# EAGLE design untitled (EAGLE 6.6.0)
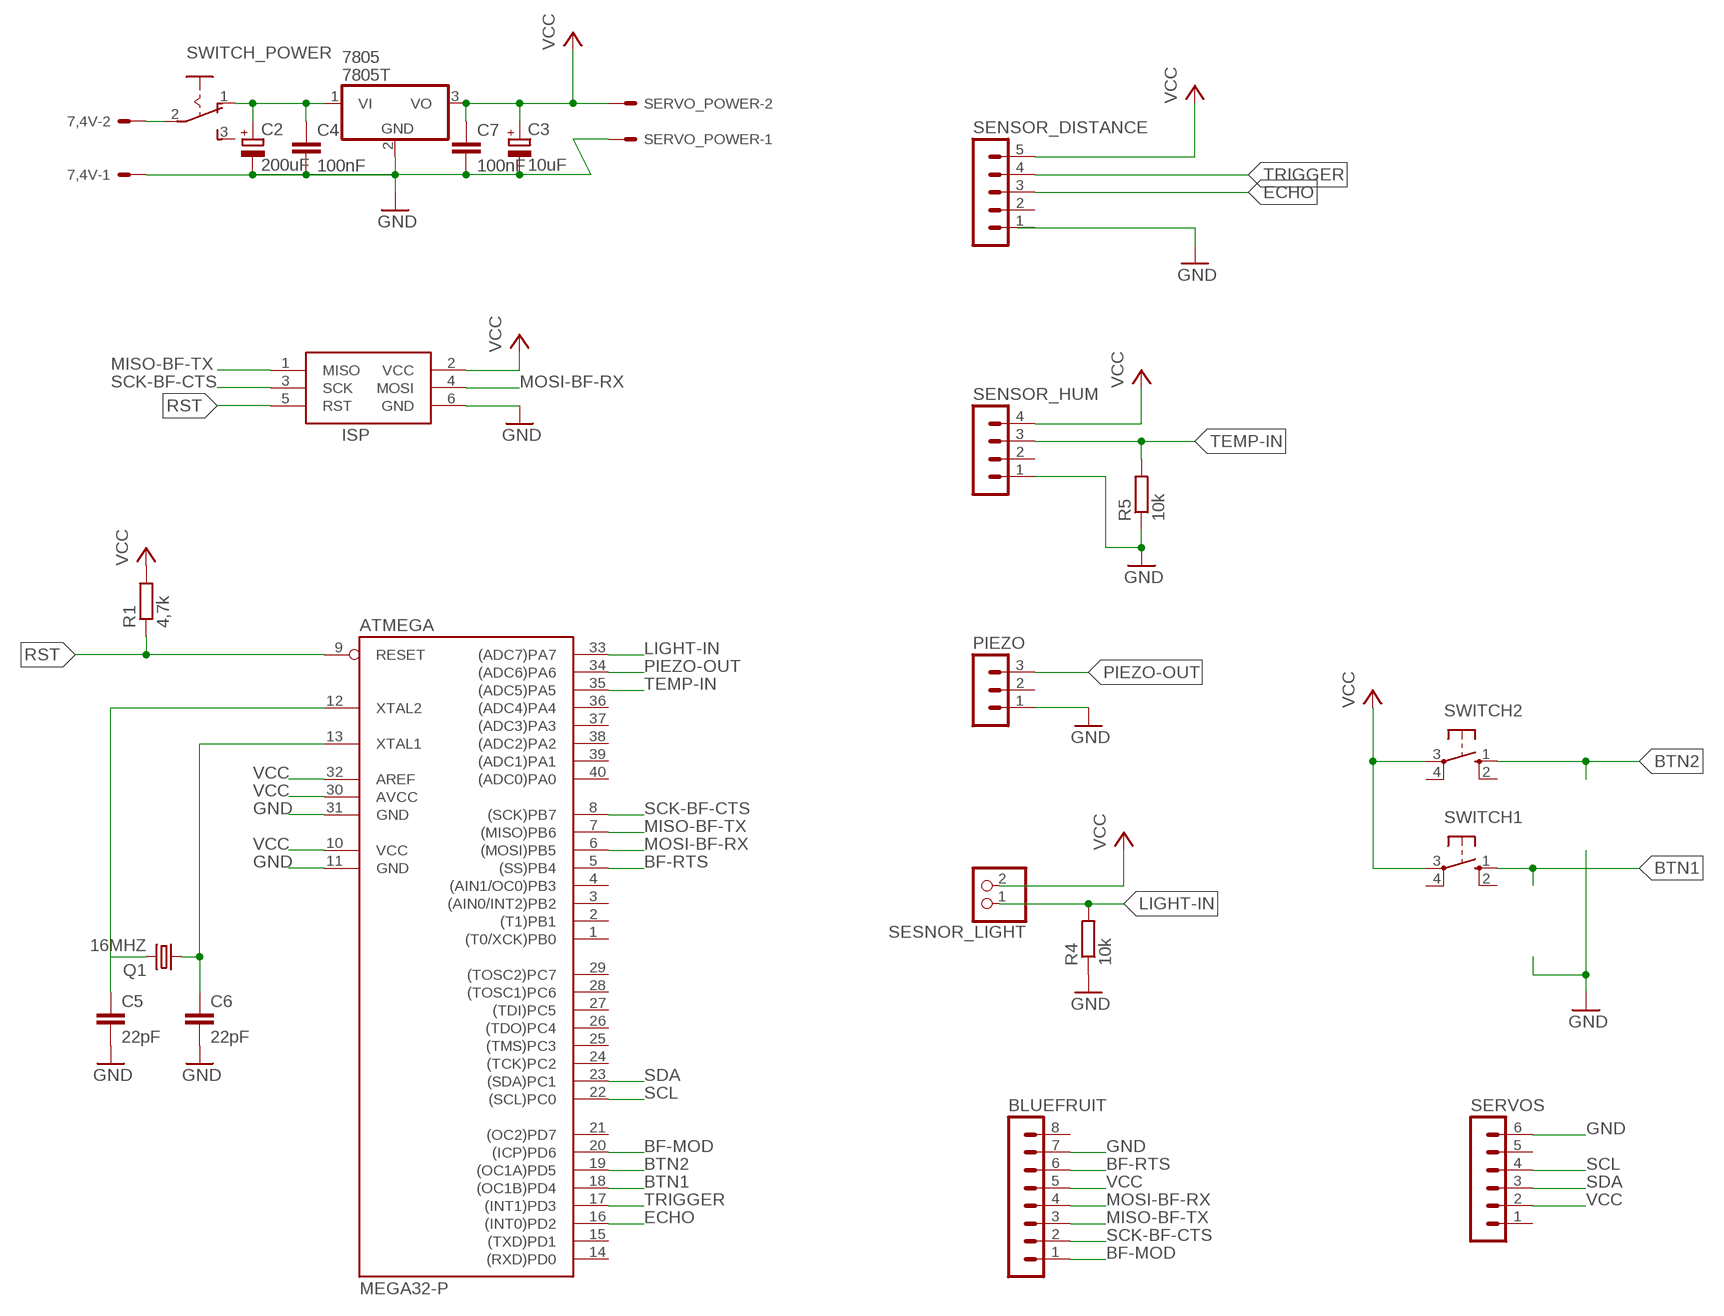
[diagram p0: schematic, sheet 1]

## Parts
7,4V  KK-156-2  [KK-156-2]
7805  7805T  [TO220H]
ATMEGA  MEGA32-P  [DIL40]
BLUEFRUIT  MA08-1  [MA08-1]
C2  200uF  CPOL-EUE5-10.5  [E5-10,5]
C3  10uF  CPOL-EUE5-10.5  [E5-10,5]
C4  100nF  C-EU025-025X050  [C025-025X050]
C5  22pF  C-EU025-025X050  [C025-025X050]
C6  22pF  C-EU025-025X050  [C025-025X050]
C7  100nF  C-EU025-025X050  [C025-025X050]
ISP  AVRISP-6  [AVRISP]
PIEZO  MA03-1  [MA03-1]
Q1  16MHZ  CRYSTALHC49S  [HC49/S]
R1  4,7k  R-EU_0207/10  [0207/10]
R4  10k  R-EU_0207/10  [0207/10]
R5  10k  R-EU_0207/10  [0207/10]
SENSOR_DISTANCE  MA05-1  [MA05-1]
SENSOR_HUM  MA04-1  [MA04-1]
SERVO_POWER  KK-156-2  [KK-156-2]
SERVOS  MA06-1  [MA06-1]
SESNOR_LIGHT  PINHD-1X2  [1X02]
SWITCH1  10-XX  [B3F-10XX]
SWITCH2  10-XX  [B3F-10XX]
SWITCH_POWER  255SB  [255SB]

## Nets
BF-MOD: ATMEGA.20((ICP)PD6) BLUEFRUIT.1
BF-RTS: ATMEGA.5((SS)PB4) BLUEFRUIT.6
BTN1: ATMEGA.18((OC1B)PD4) SWITCH1.1(S)
BTN2: ATMEGA.19((OC1A)PD5) SWITCH2.1(S)
ECHO: ATMEGA.16((INT0)PD2) SENSOR_DISTANCE.3
GND: 7,4V.1 7805.2(GND) ATMEGA.11(GND) ATMEGA.31(GND) BLUEFRUIT.7 C2.- C3.- C4.2 C5.2 C6.2 C7.2 ISP.6(GND) PIEZO.1 R4.1 R5.1 SENSOR_HUM.1 SERVO_POWER.1 SERVOS.6
LIGHT-IN: ATMEGA.33((ADC7)PA7) R4.2 SESNOR_LIGHT.1
MISO-BF-TX: ATMEGA.7((MISO)PB6) BLUEFRUIT.3 ISP.1(MISO)
MOSI-BF-RX: ATMEGA.6((MOSI)PB5) BLUEFRUIT.4 ISP.4(MOSI)
N$1: 7,4V.2 SWITCH_POWER.2(P)
N$2: ATMEGA.12(XTAL2) C5.1 Q1.2
N$3: ATMEGA.13(XTAL1) C6.1 Q1.1
PIEZO-OUT: ATMEGA.34((ADC6)PA6) PIEZO.3
RST: ATMEGA.9(RESET) ISP.5(RST) R1.1
SCK-BF-CTS: ATMEGA.8((SCK)PB7) BLUEFRUIT.2 ISP.3(SCK)
SCL: ATMEGA.22((SCL)PC0) SERVOS.4
SDA: ATMEGA.23((SDA)PC1) SERVOS.3
TEMP-IN: ATMEGA.35((ADC5)PA5) R5.2 SENSOR_HUM.3
TRIGGER: ATMEGA.17((INT1)PD3) SENSOR_DISTANCE.4
VCC: 7805.3(VO) ATMEGA.10(VCC) ATMEGA.30(AVCC) ATMEGA.32(AREF) BLUEFRUIT.5 C3.+ C7.1 ISP.2(VCC) R1.2 SENSOR_DISTANCE.5 SENSOR_HUM.4 SERVO_POWER.2 SERVOS.2 SESNOR_LIGHT.2 SWITCH1.3(P) SWITCH2.3(P)
VIN: 7805.1(VI) C2.+ C4.1 SWITCH_POWER.1(O)
Unconnected: ATMEGA.1((T0/XCK)PB0) ATMEGA.2((T1)PB1) ATMEGA.3((AIN0/INT2)PB2) ATMEGA.4((AIN1/OC0)PB3) ATMEGA.14((RXD)PD0) ATMEGA.15((TXD)PD1) ATMEGA.21((OC2)PD7) ATMEGA.24((TCK)PC2) ATMEGA.25((TMS)PC3) ATMEGA.26((TDO)PC4) ATMEGA.27((TDI)PC5) ATMEGA.28((TOSC1)PC6) ATMEGA.29((TOSC2)PC7) ATMEGA.36((ADC4)PA4) ATMEGA.37((ADC3)PA3) ATMEGA.38((ADC2)PA2) ATMEGA.39((ADC1)PA1) ATMEGA.40((ADC0)PA0) BLUEFRUIT.8 PIEZO.2 SENSOR_DISTANCE.1 SENSOR_DISTANCE.2 SENSOR_HUM.2 SERVOS.1 SERVOS.5 SWITCH1.2(S1) SWITCH1.4(P1) SWITCH2.2(S1) SWITCH2.4(P1) SWITCH_POWER.3(S)

## Library data of the parts
7,4V SERVO_POWER = con-molex:KK-156-2: KK 156 HEADER Source: http://www.molex.com/pdm_docs/sd/026604100_sd.pdf; OC_FARNELL: unknown; OC_NEWARK: unknown
7805 = adafruit:78*: Positive VOLTAGE REGULATOR Added bigger pads to the TO-92 package
ATMEGA = atmel:MEGA32-P: MICROCONTROLLER 32 Kbytes FLASH 2 Kbytes SRAM 1 Kbytes EEPROM USART 8-channel 10 bit ADC Source: www.atmel.com .. doc2503.pdf; MPN: ATMEGA32-16PU; OC_FARNELL: 1661729; OC_NEWARK: 51P1794
BLUEFRUIT = con-lstb:MA08-1: PIN HEADER; OC_FARNELL: unknown; OC_NEWARK: unknown
C2 C3 = rcl:CPOL-EU: POLARIZED CAPACITOR, European symbol
C4-C7 = rcl:C-EU: CAPACITOR, European symbol
ISP = adafruit:AVRISP: AVR ISP HEADER Standard 6 pin header for AVR programming
PIEZO = con-lstb:MA03-1: PIN HEADER; OC_FARNELL: unknown; OC_NEWARK: unknown
Q1 = crystal:CRYSTAL: CRYSTAL; OC_FARNELL: 1667008; OC_NEWARK: unknown
R1 R4 R5 = rcl:R-EU_: RESISTOR, European symbol
SENSOR_DISTANCE = con-lstb:MA05-1: PIN HEADER; OC_FARNELL: unknown; OC_NEWARK: unknown
SENSOR_HUM = con-lstb:MA04-1: PIN HEADER; OC_FARNELL: unknown; OC_NEWARK: unknown
SERVOS = con-lstb:MA06-1: PIN HEADER; OC_FARNELL: unknown; OC_NEWARK: unknown
SESNOR_LIGHT = pinhead:PINHD-1X2: PIN HEADER
SWITCH1 SWITCH2 = switch-omron:10-XX: OMRON SWITCH; MPN: B3F-1000; OC_FARNELL: 176432; OC_NEWARK: 36M3542
SWITCH_POWER = switch:255SB: SLIDING SWITCH Distributor Buerklin, 11G810

## Board
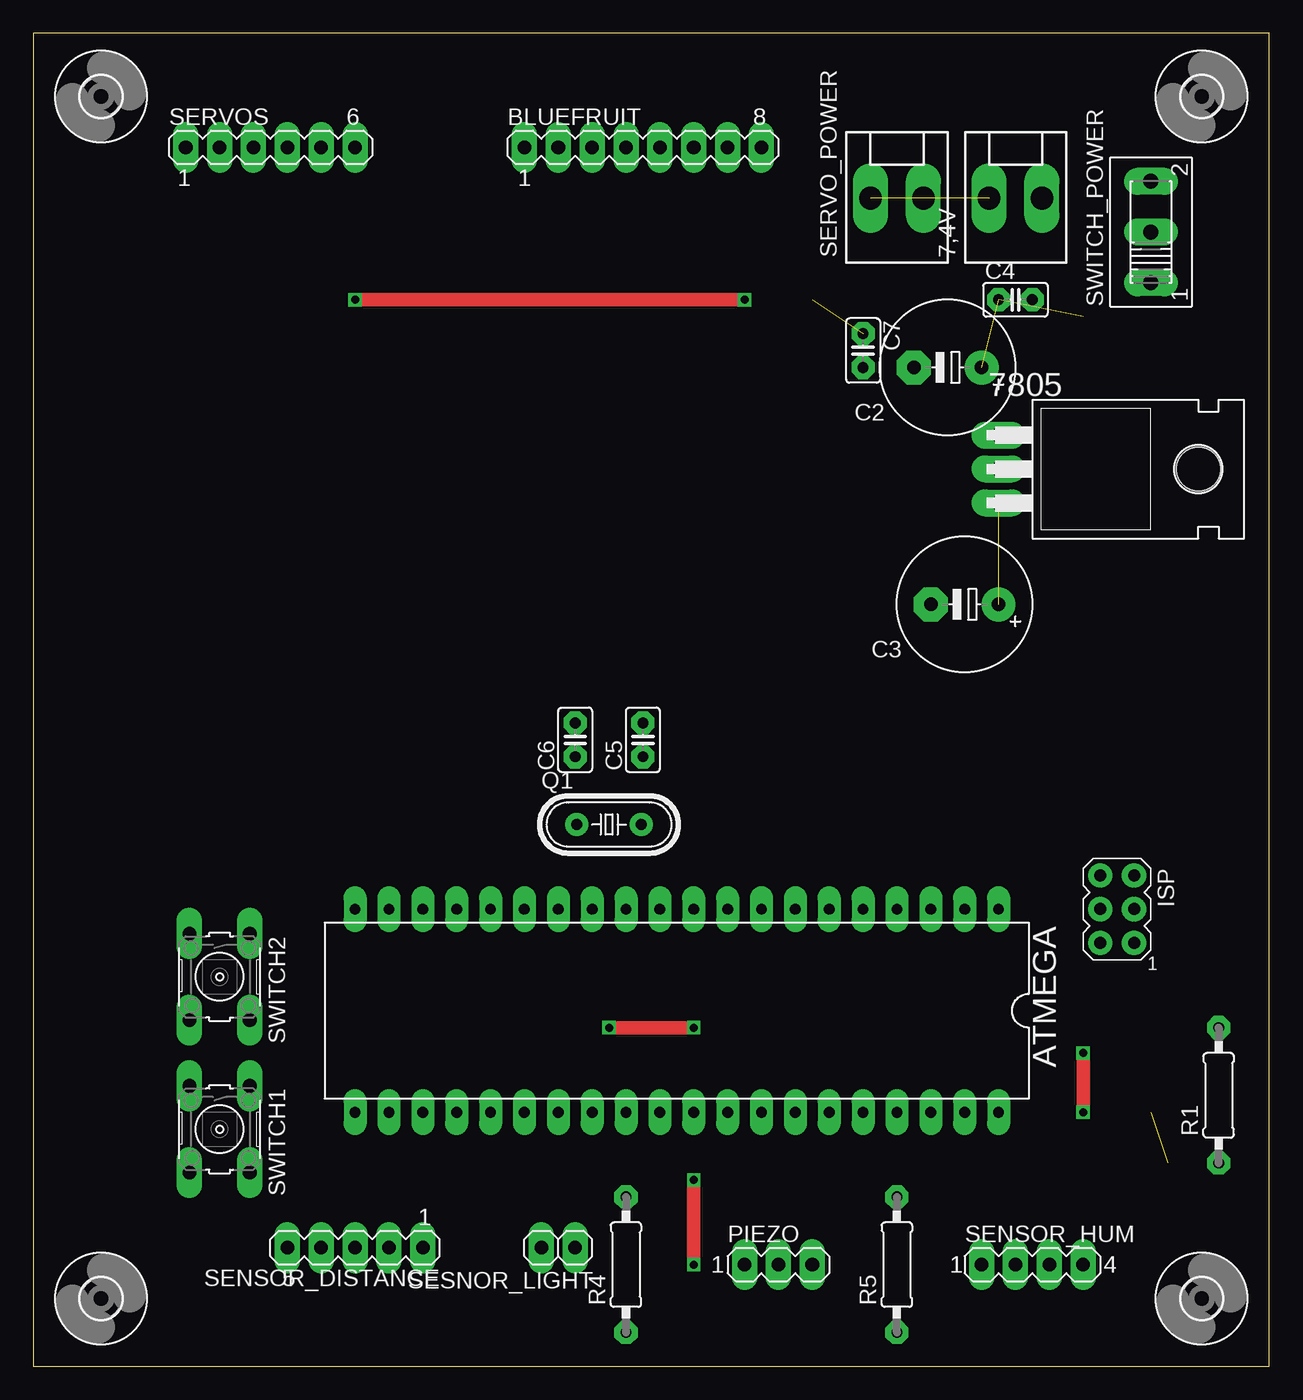
[diagram p1: board, top side]
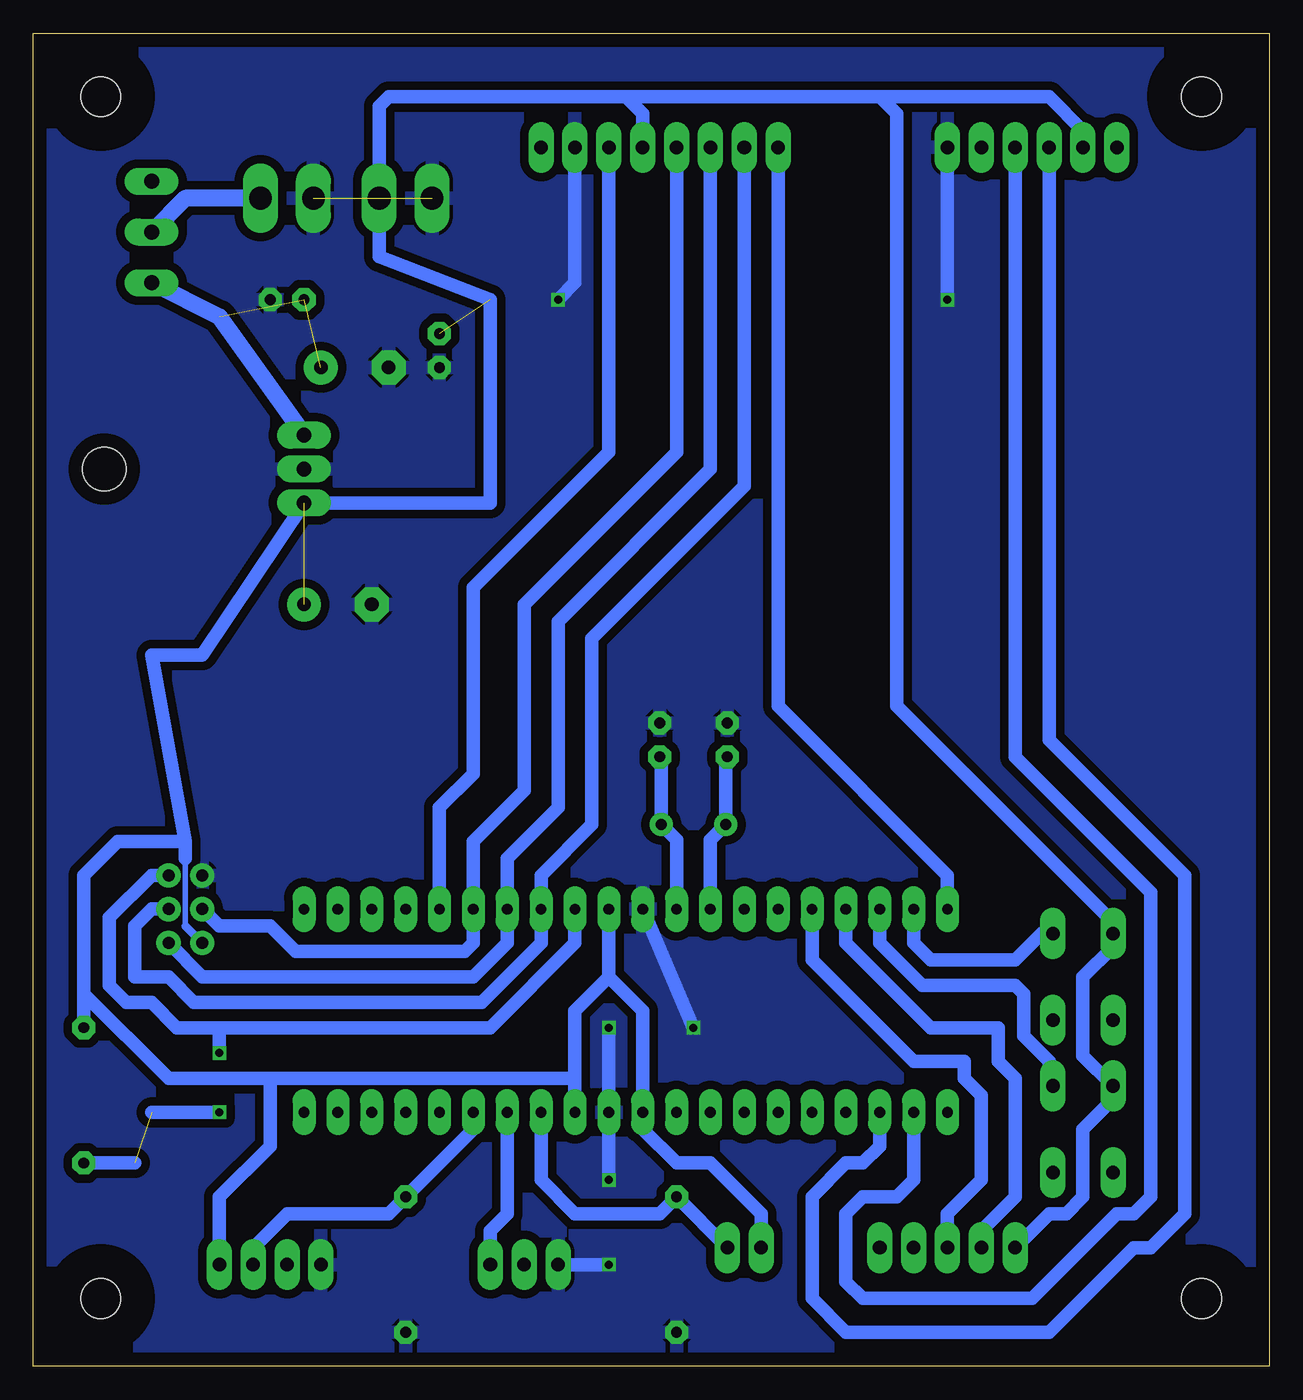
[diagram p2: board, bottom side, seen from below]

Size 92.69 x 100 mm. Coordinates in mm from the lower left corner, seen from the top.
Outline: 0,0 92.69,0 92.69,100 0,100 0,0
Copper layers (1*16): Top 0.035mm / dielectric 1.5mm / Bottom 0.035mm
Design rules "default *": minimum track width 10mil, minimum drill 24mil, track to track 25mil, track to pad 25mil, pad to pad 25mil, via to via 25mil, smd to smd 25mil, copper to edge 40mil, drill to drill 8mil, minimum pad ring 18mil, minimum via ring 8mil, stop-mask expansion 4mil, vias tented up to drill 0mil, thermal gap 10mil

### Footprints (pad centres in the part's own frame; a part is rotated, then mirrored left to right if it is on the bottom)
KK-156-2 = drill 1.7 pad 2.184 long: 1 -1.98,0; 2 1.98,0
TO220H = drill 1.118 long: 1 -2.54,-10.16; 2 0,-10.16; 3 2.54,-10.16 | hole 3.302: 0,4.826
DIL40 = drill 0.813 long: 1 -24.13,-7.62; 2 -21.59,-7.62; 3 -19.05,-7.62; 4 -16.51,-7.62; 5 -13.97,-7.62; 6 -11.43,-7.62; 7 -8.89,-7.62; 8 -6.35,-7.62; 9 -3.81,-7.62; 10 -1.27,-7.62; 11 1.27,-7.62; 12 3.81,-7.62; 13 6.35,-7.62; 14 8.89,-7.62; 15 11.43,-7.62; 16 13.97,-7.62; 17 16.51,-7.62; 18 19.05,-7.62; 19 21.59,-7.62; 20 24.13,-7.62; 21 24.13,7.62; 22 21.59,7.62; 23 19.05,7.62; 24 16.51,7.62; 25 13.97,7.62; 26 11.43,7.62; 27 8.89,7.62; 28 6.35,7.62; 29 3.81,7.62; 30 1.27,7.62; 31 -1.27,7.62; 32 -3.81,7.62; 33 -6.35,7.62; 34 -8.89,7.62; 35 -11.43,7.62; 36 -13.97,7.62; 37 -16.51,7.62; 38 -19.05,7.62; 39 -21.59,7.62; 40 -24.13,7.62
MA08-1 = drill 1.016 long: 1 -8.89,0; 2 -6.35,0; 3 -3.81,0; 4 -1.27,0; 5 1.27,0; 6 3.81,0; 7 6.35,0; 8 8.89,0
E5-10,5 = drill 1.016 pad 2.54: + -2.54,0 | drill 1.016 pad 2.54 octagon: - 2.54,0
C025-025X050 = drill 0.813 octagon: 1 -1.27,0; 2 1.27,0
AVRISP = drill 0.9 pad 1.626: 1 -1.27,2.54; 2 1.27,2.54; 3 -1.27,0; 4 1.27,0; 5 -1.27,-2.54; 6 1.27,-2.54
MA03-1 = drill 1.016 long: 1 -2.54,0; 2 0,0; 3 2.54,0
HC49/S = drill 0.813: 1 -2.413,0; 2 2.413,0
0207/10 = drill 0.813 octagon: 1 -5.08,0; 2 5.08,0
MA05-1 = drill 1.016 long: 1 -5.08,0; 2 -2.54,0; 3 0,0; 4 2.54,0; 5 5.08,0
MA04-1 = drill 1.016 long: 1 -3.81,0; 2 -1.27,0; 3 1.27,0; 4 3.81,0
MA06-1 = drill 1.016 long: 1 -6.35,0; 2 -3.81,0; 3 -1.27,0; 4 1.27,0; 5 3.81,0; 6 6.35,0
1X02 = drill 1.016 long: 1 -1.27,0; 2 1.27,0
B3F-10XX = drill 1.016 long: 1 -3.251,2.261; 2 3.251,2.261; 3 -3.251,-2.261; 4 3.251,-2.261
255SB = drill 1.118 long: 1 -3.81,0; 2 0,0; 3 3.81,0
3,0 = hole 3: 0,0

### Placement (x,y rotation side)
7,4V  73.66,87.63 0 top
7805  82.55,67.31 270 top
ATMEGA  48.26,26.67 180 top
BLUEFRUIT  45.72,91.44 0 top
C2  68.58,74.93 180 top
C3  69.85,57.15 180 top
C4  73.66,80.01 0 top
C5  45.72,46.99 90 top
C6  40.64,46.99 90 top
C7  62.23,76.2 270 top
ISP  81.28,34.29 180 top
PIEZO  55.88,7.62 0 top
Q1  43.18,40.64 0 top
R1  88.9,20.32 90 top
R4  44.45,7.62 90 top
R5  64.77,7.62 90 top
SENSOR_DISTANCE  24.13,8.89 180 top
SENSOR_HUM  74.93,7.62 0 top
SERVO_POWER  64.77,87.63 0 top
SERVOS  17.78,91.44 0 top
SESNOR_LIGHT  39.37,8.89 180 top
SWITCH1  13.97,17.78 270 top
SWITCH2  13.97,29.21 270 top
SWITCH_POWER  83.82,85.09 90 top
U$1  [3,0]  5.08,95.25 0 top
U$2  [3,0]  87.63,95.25 0 top
U$3  [3,0]  87.63,5.08 0 top
U$4  [3,0]  5.08,5.08 0 top

### Tracks (layer width: path | path; a pad name or v marks a point on that pad's centre or on a via)
BF-MOD
  Bottom 1.016: ATMEGA.20 24.13,36.83 36.83,49.53 BLUEFRUIT.1
BF-RTS
  Bottom 1.016: BLUEFRUIT.6 49.53,68.58 59.69,58.42 59.69,44.45 62.23,41.91 ATMEGA.5
BTN1
  Bottom 1.016: SWITCH1.1 16.51,21.31 16.51,22.86 18.41,24.77 18.41,27.94 19.05,28.57 26.04,28.57 29.21,31.75 ATMEGA.18
BTN2
  Bottom 1.016: SWITCH2.1 17.07,32.46 19.05,30.48 25.4,30.48 26.67,31.75 ATMEGA.19
ECHO
  Bottom 1.016: SENSOR_DISTANCE.3 24.13,11.43 21.59,13.97 21.59,20.32 22.86,21.59 22.86,22.86 26.67,22.86 34.29,30.48 ATMEGA.16
GND  (via drill 0.6)  (1 unrouted)
  Top 1.016: v49.53,7.62 v49.53,13.97 | v24.13,80.01 v53.34,80.01 | v49.53,25.4 v43.18,25.4
  Bottom 1.016: PIEZO.1 v49.53,7.62 | v49.53,13.97 ATMEGA.31 v49.53,25.4 | SERVOS.6 v24.13,80.01 | v53.34,80.01 52.07,81.28 BLUEFRUIT.7 | v43.18,25.4 ATMEGA.11
  pour Bottom: -1.27,0 93.98,0 93.98,100.33 -1.27,100.33
LIGHT-IN
  Bottom 1.016: SESNOR_LIGHT.1 R4.2 45.72,11.43 52.07,11.43 54.61,13.97 ATMEGA.33
MISO-BF-TX
  Bottom 1.016: BLUEFRUIT.3 41.91,67.31 53.34,55.88 53.34,41.91 57.15,38.1 ATMEGA.7 57.15,31.75 59.69,29.21 80.01,29.21 ISP.1
MOSI-BF-RX
  Bottom 1.016: BLUEFRUIT.4 44.45,68.58 55.88,57.15 55.88,43.18 59.69,39.37 ATMEGA.6 59.69,31.75 60.33,31.11 73.03,31.11 74.93,33.02 78.74,33.02 ISP.4
N$1
  Bottom 1.27: 7,4V.2 81.28,87.63 SWITCH_POWER.2
N$2
  Bottom 1.016: ATMEGA.12 44.45,39.5 Q1.2 45.59,45.59 C5.1
N$3
  Bottom 1.016: ATMEGA.13 41.91,39.5 Q1.1 40.77,45.59 C6.1
PIEZO-OUT
  Bottom 1.016: PIEZO.3 58.42,10.16 57.15,11.43 ATMEGA.34
RST  (via drill 0.6)  (1 unrouted)
  Top 1.016: v78.74,19.05 v78.74,23.5
  Bottom 1.016: ISP.5 83.82,36.83 87,33.66 87,28.57 85.72,27.3 83.82,27.3 81.92,25.4 78.74,25.4 | 78.74,25.4 58.42,25.4 52.07,31.75 ATMEGA.9 | 85.09,15.24 R1.1 | 83.82,19.05 v78.74,19.05 | v78.74,23.5 78.74,25.4
SCK-BF-CTS
  Bottom 1.016: BLUEFRUIT.2 39.37,66.04 50.8,54.61 50.8,40.64 54.61,36.83 ATMEGA.8 54.61,31.75 59.05,27.3 80.64,27.3 82.55,29.21 85.09,29.21 85.09,33.02 83.82,34.29 ISP.3
SCL
  Bottom 1.016: ATMEGA.22 26.67,13.97 27.94,12.7 30.48,12.7 31.75,11.43 31.75,6.35 30.48,5.08 17.78,5.08 11.43,11.43 10.16,11.43 8.89,12.7 8.89,35.56 19.05,45.72 SERVOS.4
SDA
  Bottom 1.016: SERVOS.3 16.51,46.99 6.35,36.83 6.35,11.43 8.89,8.89 10.16,8.89 16.51,2.54 31.75,2.54 34.29,5.08 34.29,12.7 31.75,15.24 30.48,15.24 29.21,16.51 ATMEGA.23
TEMP-IN
  Bottom 1.016: ATMEGA.35 59.69,17.78 R5.2 66.04,11.43 73.66,11.43 76.2,8.89 SENSOR_HUM.3
TRIGGER
  Bottom 1.016: ATMEGA.17 31.75,31.75 25.4,25.4 20.32,25.4 20.32,22.86 19.05,21.59 19.05,12.7 21.59,10.16 SENSOR_DISTANCE.4
VCC  (2 unrouted)
  Bottom 0.406: 81.28,33.02 81.28,38.1
  Bottom 0.61: ISP.2 81.28,33.02
  Bottom 1.016: SENSOR_DISTANCE.5 16.51,11.43 15.24,11.43 13.97,12.7 13.97,17.78 11.71,20.04 SWITCH1.3 13.97,23.29 13.97,29.21 11.71,31.47 SWITCH2.3 11.71,33.3 27.94,49.53 27.94,93.98 29.21,95.25 | 48.26,95.25 66.04,95.25 66.75,94.54 SERVO_POWER.2 66.75,83.26 58.42,80.01 58.42,64.77 7805.3 80.01,53.34 83.82,53.34 81.28,39.37 | 48.26,95.25 46.99,93.98 BLUEFRUIT.5 | SERVOS.2 13.97,92.71 16.51,95.25 29.21,95.25 | SESNOR_LIGHT.2 38.1,11.43 41.91,15.24 44.45,15.24 46.99,17.78 ATMEGA.30 46.99,26.67 49.53,29.21 | ATMEGA.10 49.53,29.21 | 81.28,38.1 81.28,39.37 | 81.28,39.37 86.36,39.37 88.9,36.83 88.9,27.94 | 88.9,27.94 82.55,21.59 74.93,21.59 | 74.93,21.59 52.07,21.59 ATMEGA.32 52.07,26.67 49.53,29.21 | 29.21,95.25 48.26,95.25 | R1.2 88.9,27.94 | SENSOR_HUM.4 78.74,12.7 74.93,16.51 74.93,21.59
VIN  (2 unrouted)
  Bottom 1.27: SWITCH_POWER.1 78.74,78.74 7805.1